# EasyEDA Pro project DAPLink-HS.eprj

# Schematic DAPLink-HS
Board Name: DAPLink-HS; Create Date: 2023-05-25; Page Name: Core; Project Name: DAPLink-HS; Schematic Name: DAPLink-HS; Update Date: 2025-05-06; Company: 嘉立创EDA; Page Size: A4; Version: V1.0
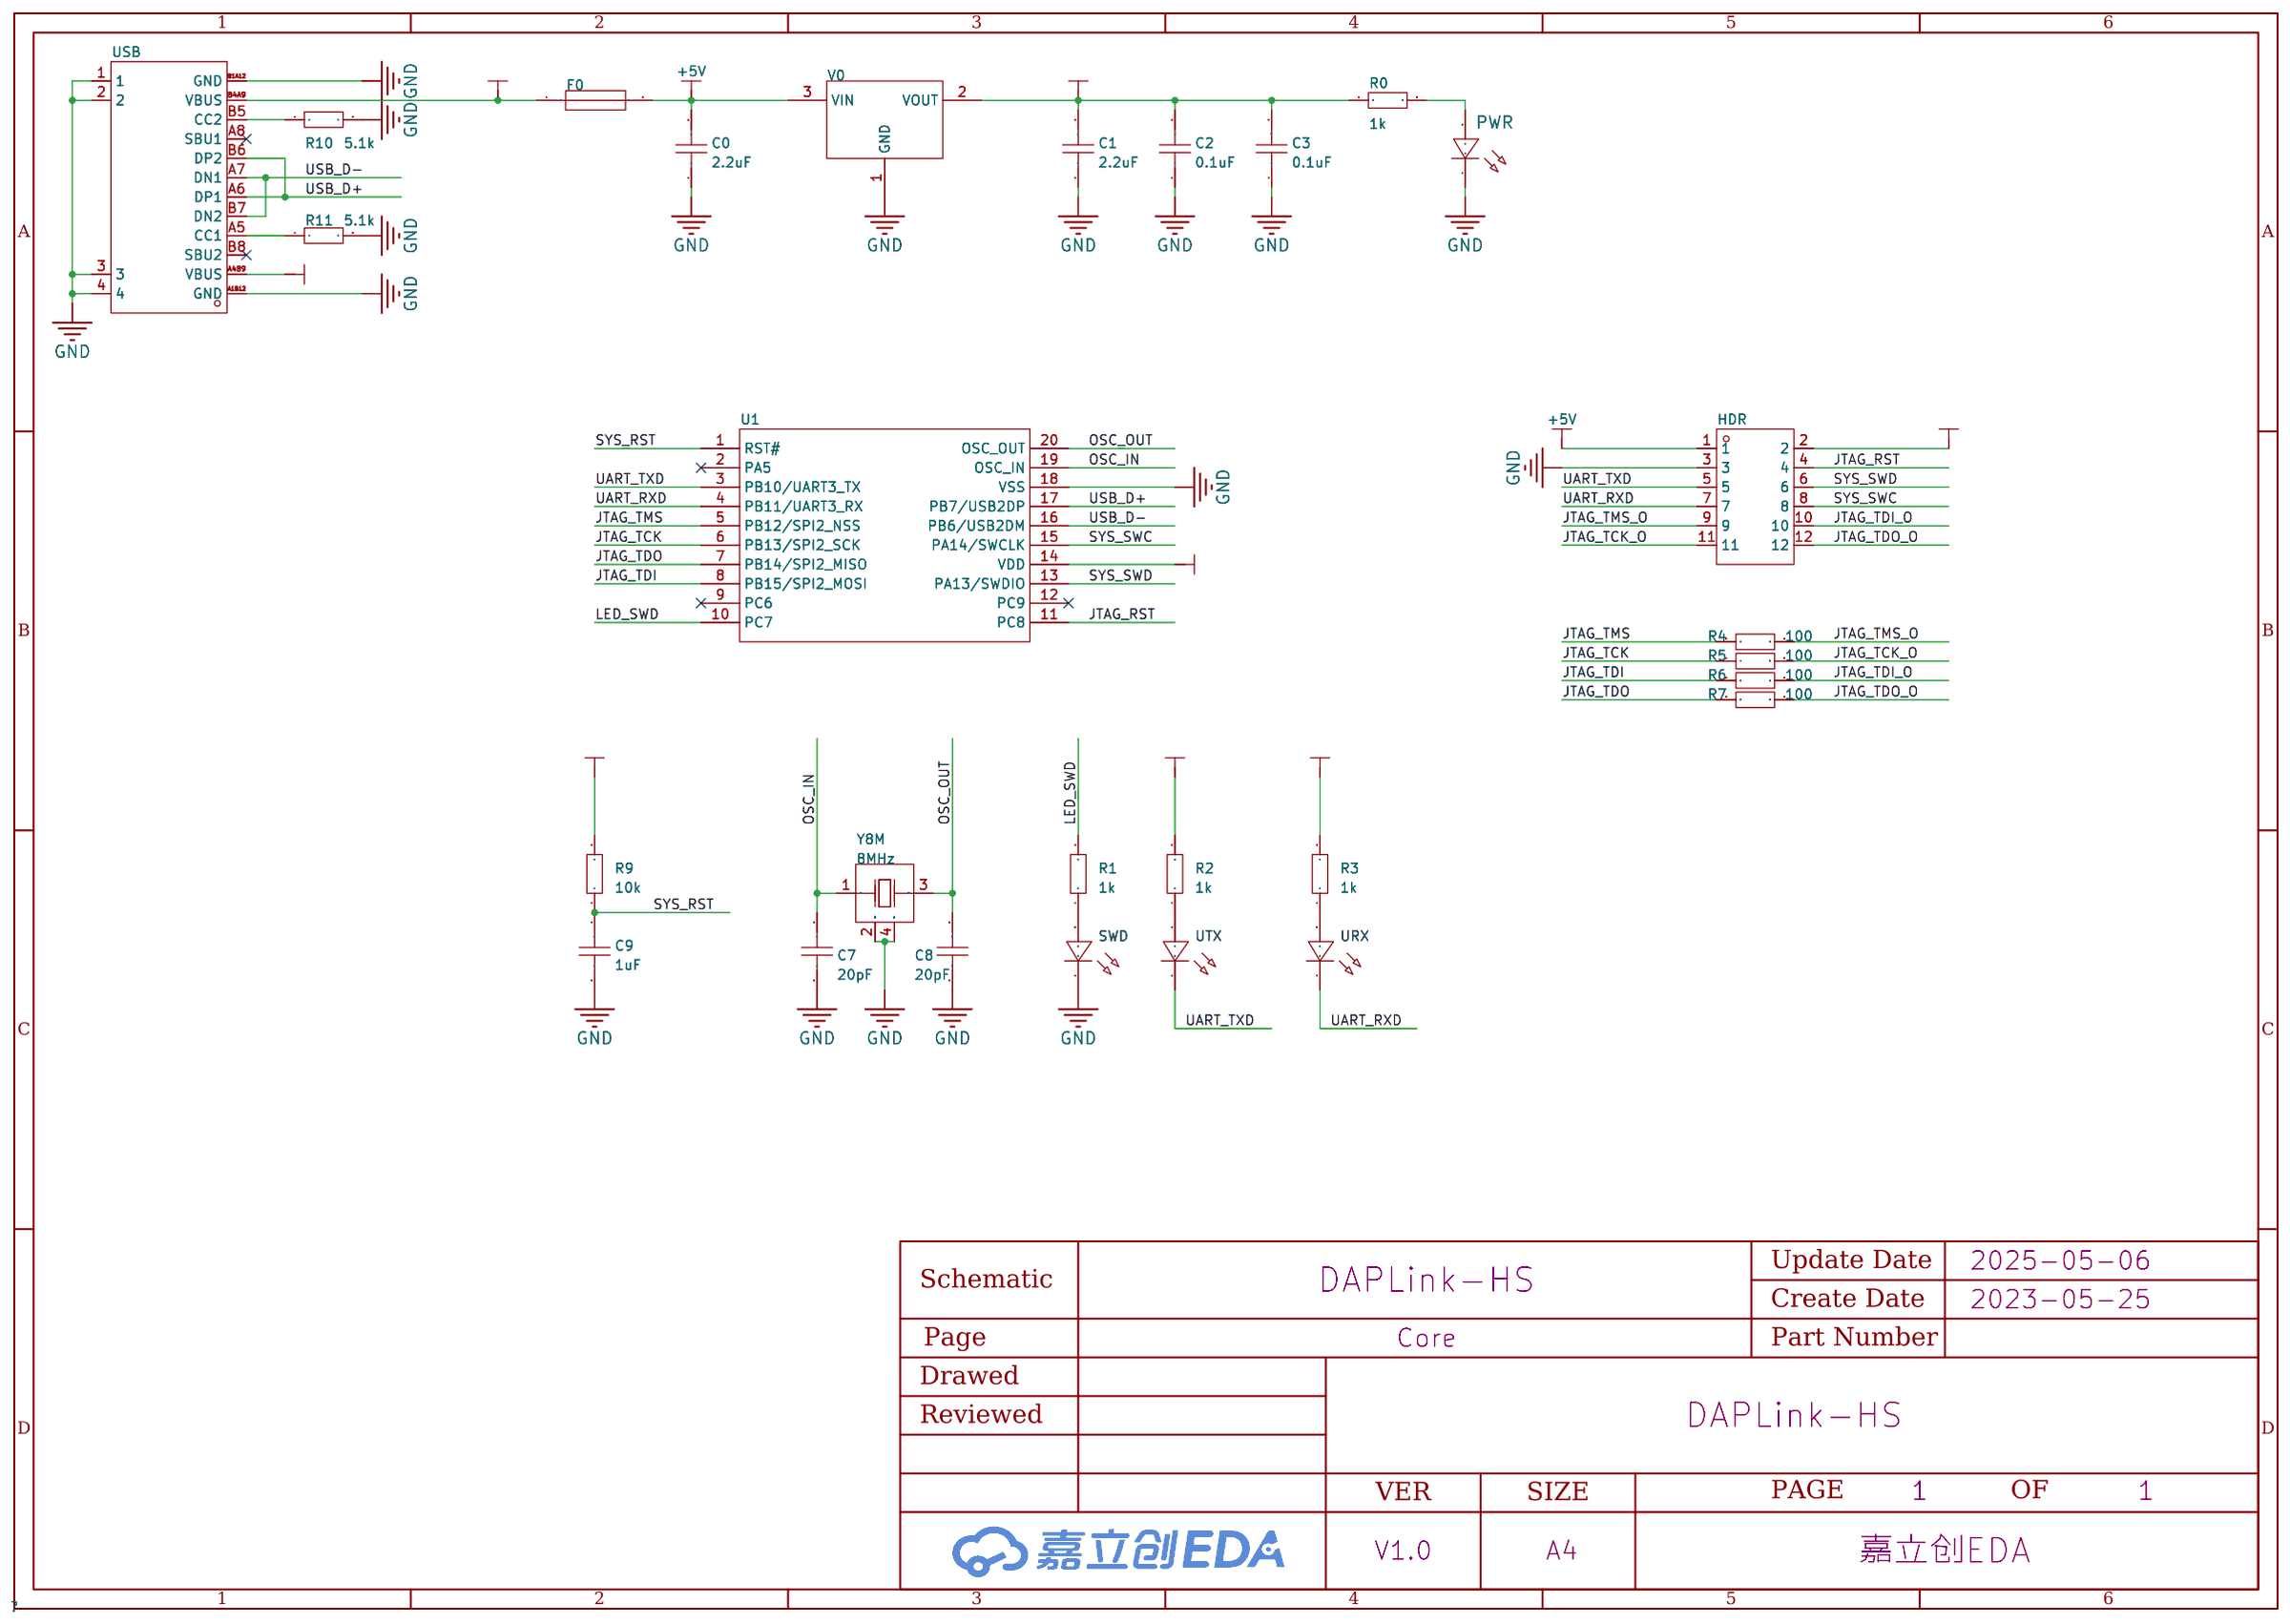
[diagram p0: schematic sheet]

## Parts
C0  2.2uF  [C0603]
C1  2.2uF  [C0603]
C2  0.1uF  [C0603]
C3  0.1uF  [C0603]
C7  20pF  [C0603]
C8  20pF  [C0603]
C9  1uF  [C0603]
F0  JK-nSMD050-30  [F1206]
HDR  -  [HDR-SMD_2X6P-P2.54]
PWR  -  [LED0603-RD_BLUE]
R0  1k  [R0603]
R1  1k  [R0603]
R2  1k  [R0603]
R3  1k  [R0603]
R4  100  [R0603]
R5  100  [R0603]
R6  100  [R0603]
R7  100  [R0603]
R9  10k  [R0603]
R10  5.1k  [R0603]
R11  5.1k  [R0603]
SWD  -  [LED_0603]
U1  -  [TSSOP-20_L6.5-W4.4-P0.65-LS6.4-BL]
URX  -  [LED_0603]
USB  USB-TYPE-C-017  [USB-TYPE-C-SMD_C9900008089]
UTX  -  [LED_0603]
V0  HT7233  [SOT-23-3_L2.9-W1.6-P1.90-LS2.8-BR]
Y8M  8MHz  [OSC-SMD_4P-L3.2-W2.5-BL]

## Library data of the parts
C0-C3 C7-C9 = CAP_0603: 容值:100nF;精度:±10%;额定电压:50V;温度系数:X7R;; Supplier Footprint: 0603
F0 = JK-nSMD050-30: LCSC Part Name: 30V 500mA 1206自恢复; Supplier Part: C720075; Manufacturer: JK(金科); Supplier Footprint: 1206; JLCPCB Part Class: 扩展库; Datasheet: https://atta.szlcsc.com/upload/public/pdf/source/20200810/C720075_06AF2D4541537091880CC35F0EFB49F8.pdf; Supplier: LCSC; Voltage - Max: 30V; Current - Max: 100A; Hold Current: 500mA; Trip Current: 1A; Power Dissipation: 600mW; Resistance - Initial (Ri) (Min): 150mΩ; Resistance - Post Trip (R1) (Max): 300mΩ; Time to Trip(Max): 100ms
HDR = HDR-M_2.54_2x6: Supplier Part: C30734; Supplier Footprint: 插件,P=2.54mm
PWR = LED_0603-R: 发光颜色:红灯;二极管配置:-;透镜颜色:无色透明;主波长:617.5nm;峰值波长:632nm;色温:-;光通量(25时):-;测试电流:5mA;正向电压(VF):2.2V;发光强度:28.5mcd;功率:60mW;发光角度:120°;安装方式:-;工作温度:-40~+85;; Supplier Footprint: 0603; Supplier Part: C72044
R0-R7 R9-R11 = Res_0603: Supplier Footprint: 0603
SWD = LED_0603-G: Supplier Footprint: 0603
U1 = CH32V305FBP6
URX UTX = LED_0603-B: Supplier Footprint: 0603
USB = USB-TYPE-C-017: 连接器类型:Type-C;标准:-;公母:母座;触点数量:16;端口数量:1;安装方式:卧贴;额定电流 - 电源:3A;工作温度范围:-25~+85;; Supplier Part: C2927037; Manufacturer: DEALON(德艺隆); Supplier Footprint: SMD; JLCPCB Part Class: 扩展库; Datasheet: https://atta.szlcsc.com/upload/public/pdf/source/20211217/653222EE5174722C9DFE2966329956D8.pdf; Supplier: LCSC; Connector Type: Type-C; Gender: 母座; Number of Contacts: 16; Number of Ports: 1; Mounting Style: 卧贴; Current Rating - Power (Max): 3A; Operating Temperature Range: -25~+85
V0 = HT7233: LCSC Part Name: 输入8V 输出3.3V 300mA; Supplier Part: C47970; Manufacturer: HOLTEK(合泰/盛群); Supplier Footprint: SOT-23; JLCPCB Part Class: 扩展库; Datasheet: https://atta.szlcsc.com/upload/public/pdf/source/20240403/3BB5021AF80A3BCA9E8A25AC89304087.pdf; Supplier: LCSC; Output Type: 固定; Maximum Input Voltage: 8V; Output Voltage: 3.3V; MAX Output Current: 300mA; Dropout Voltage: 300mV@(300mA); Output Polarity: 正极; Number of Outputs: 1
Y8M = X322512MSB4SI: 晶振类型:贴片无源晶振;频率:12MHz;频率公差:±10ppm;频率稳定度:±30ppm;负载电容:20pF;工作温度:-40~+85;; LCSC Part Name: 12MHz ±10ppm 20pF; Supplier Part: C9002; Manufacturer: YXC(扬兴晶振); Supplier Footprint: SMD3225-4P; JLCPCB Part Class: 基础库; Datasheet: https://atta.szlcsc.com/upload/public/pdf/source/20210329/C112971_1F611BDC486E193C1706F6D8EB5AA189.pdf; Supplier: LCSC; Crystal Type: 贴片无源晶振; Frequency Tolerance: ±10ppm; Frequency Stability: ±30ppm; Load Capacitance: 20pF; Operating Temperature: -40~+85

## Nets
+3.3V: C1.2 C2.2 C3.2 HDR.2 R0.1 R2.2 R3.2 R9.2 U1.14(VDD) V0.2(VOUT)
+5V: C0.2 F0.2 HDR.1 V0.3(VIN)
GND: C0.1 C1.1 C2.1 C3.1 C7.2 C8.1 C9.2 HDR.3 PWR.1(C) R10.2 R11.2 SWD.1(C) U1.18(VSS) USB.1 USB.2 USB.3 USB.4 USB.A1B12(GND) USB.B1A12(GND) V0.1(GND) Y8M.2(GND) Y8M.4(GND)
VBUS: F0.1 USB.A4B9(VBUS) USB.B4A9(VBUS)
JTAG_RST: HDR.4 U1.11(PC8)
JTAG_TCK: R5.1 U1.6(PB13/SPI2_SCK)
JTAG_TCK_O: HDR.11 R5.2
JTAG_TDI: R6.1 U1.8(PB15/SPI2_MOSI)
JTAG_TDI_O: HDR.10 R6.2
JTAG_TDO: R7.1 U1.7(PB14/SPI2_MISO)
JTAG_TDO_O: HDR.12 R7.2
JTAG_TMS: R4.1 U1.5(PB12/SPI2_NSS)
JTAG_TMS_O: HDR.9 R4.2
LED_SWD: R1.2 U1.10(PC7)
OSC_IN: C7.1 U1.19(OSC_IN) Y8M.1(OSC1)
OSC_OUT: C8.2 U1.20(OSC_OUT) Y8M.3(OSC2)
SYS_RST: C9.1 R9.1 U1.1(RST#)
SYS_SWC: HDR.8 U1.15(PA14/SWCLK)
SYS_SWD: HDR.6 U1.13(PA13/SWDIO)
UART_RXD: HDR.7 U1.4(PB11/UART3_RX) URX.1(C)
UART_TXD: HDR.5 U1.3(PB10/UART3_TX) UTX.1(C)
USB_D+: U1.17(PB7/USB2DP) USB.A6(DP1) USB.B6(DP2)
USB_D-: U1.16(PB6/USB2DM) USB.A7(DN1) USB.B7(DN2)
$1N2511: R11.1 USB.A5(CC1)
$1N2512: R10.1 USB.B5(CC2)
$1N2528: PWR.2(A) R0.2
$1N14595: R1.1 SWD.2(A)
$1N14645: R2.1 UTX.2(A)
$1N14672: R3.1 URX.2(A)

Not connected (* = marked no-connect by the designer): U1 2(PA5)* 9(PC6)* 12(PC9)*; USB A8(SBU1)* B8(SBU2)*

# Board DAPLink-HS
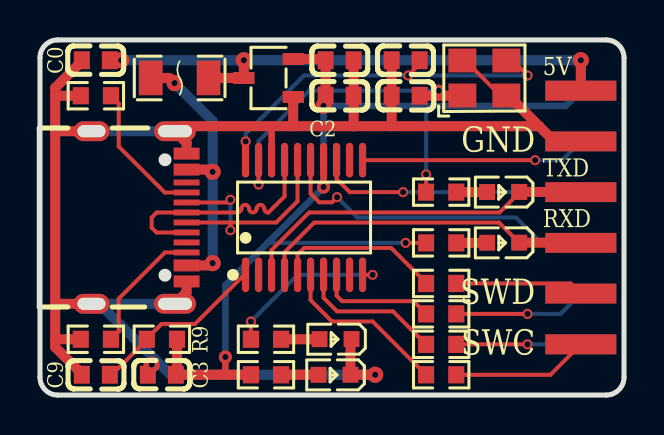
[diagram p1: board, top side]
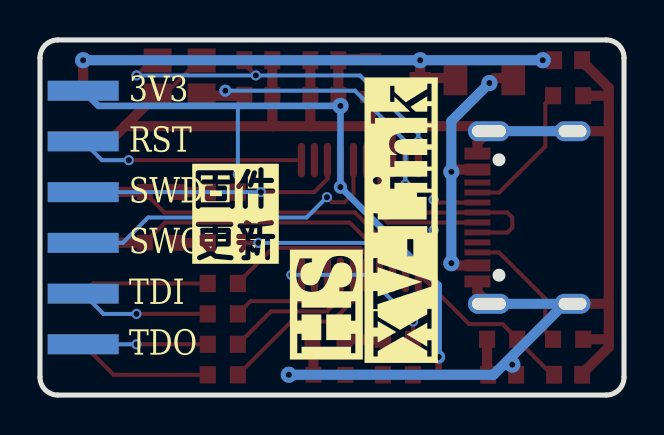
[diagram p2: board, bottom side, seen from below]

Outline 29.21 x 17.78 mm; copper layers: Top Layer, Bottom Layer. Coordinates in mm from the lower left corner of the outline.
Outline path: 0,16.89 0,0.89 arc(0.26,0.26) 0.89,0 28.32,0 arc(28.95,0.26) 29.21,0.89 29.21,16.89 arc(28.95,17.52) 28.32,17.78 0.89,17.78 arc(0.26,17.52) 0,16.89
Stack: Top Layer 0.035mm / Dielectric1 1.51mm FR4 er 4.5 / Bottom Layer 0.035mm

## Design rules (mm)
net USB_D+: DP1
net USB_D-: DP1
spacing safeClearance (default): track to track 0.152, other pairs 0.152 to 0.3
track width trackWidth (default): min 0.127, default 0.254, max 2.54
differential pair differentialPair (default): width min 0.127, default 0.254, max 2.54; gap min 0.152, default 0.152
via viaSize (default): diameter min 0.5, default 0.61, max 10; hole min 0.3, default 0.305, max 6

## Placement (name value [footprint] x y rotation side)
C0  2.2uF  [C0603]  2.79 16.76 0 top
C1  2.2uF  [C0603]  14.99 16.76 180 top
C2  0.1uF  [C0603]  14.99 14.99 180 top
C3  0.1uF  [C0603]  6.1 1.02 0 top
C7  20pF  [C0603]  18.29 14.99 180 top
C8  20pF  [C0603]  18.29 16.76 0 top
C9  1uF  [C0603]  2.79 1.02 180 top
F0  JK-nSMD050-30  [F1206]  6.99 15.88 0 top
HDR  -  [HDR-SMD_2X6P-P2.54]  27.05 15.24 0 top
PWR  -  [LED0603-RD_BLUE]  14.73 1.02 180 top
R0  1k  [R0603]  11.3 1.02 0 top
R1  1k  [R0603]  11.3 2.79 180 top
R2  1k  [R0603]  20.07 10.16 180 top
R3  1k  [R0603]  20.07 7.62 180 top
R4  100  [R0603]  20.07 5.59 0 top
R5  100  [R0603]  20.07 1.02 0 top
R6  100  [R0603]  20.07 4.06 0 top
R7  100  [R0603]  20.07 2.54 0 top
R9  10k  [R0603]  6.1 2.79 0 top
R10  5.1k  [R0603]  2.79 2.79 180 top
R11  5.1k  [R0603]  2.79 14.99 180 top
SWD  -  [LED_0603]  14.73 2.79 180 top
U1  -  [TSSOP-20_L6.5-W4.4-P0.65-LS6.4-BL]  13.21 8.89 0 top
URX  -  [LED_0603]  23.11 7.62 180 top
USB  USB-TYPE-C-017  [USB-TYPE-C-SMD_C9900008089]  4.95 8.89 270 top
UTX  -  [LED_0603]  23.11 10.16 180 top
V0  HT7233  [SOT-23-3_L2.9-W1.6-P1.90-LS2.8-BR]  11.43 15.88 0 top
Y8M  8MHz  [OSC-SMD_4P-L3.2-W2.5-BL]  22.22 15.88 0 top

## Footprints (pads in the part's own frame, mm; a bottom-side part is the same pattern mirrored in y, then rotated)
C0603
  rect 0.8x0.9 smd: 1(-0.7,0) 2(0.7,0)
F1206
  rect 1.19x1.728 smd: 1(-1.445,0) 2(1.445,0)
HDR-SMD_2X6P-P2.54
  rect 3.556x1 smd: 1(0,0) 3(0,-2.54) 5(0,-5.08) 7(0,-7.62) 9(0,-10.16) 11(0,-12.7)
  rect 3.556x1 smd far side: 2(0,0) 4(0,-2.54) 6(0,-5.08) 8(0,-7.62) 10(0,-10.16) 12(0,-12.7)
LED0603-RD_BLUE
  rect 0.8x0.8 smd: 1(-0.8,-0.003) 2(0.8,0.003)
LED_0603
  rect 0.8x0.8 smd: 1(-0.851,-0.01) 2(0.75,-0.005)
OSC-SMD_4P-L3.2-W2.5-BL
  rect 1.4x1.2 smd: 1(-1.1,-0.875) 2(1.1,-0.875) 3(1.1,0.875) 4(-1.1,0.875)
R0603
  rect 0.806x0.864 smd: 1(-0.753,0) 2(0.753,0)
SOT-23-3_L2.9-W1.6-P1.90-LS2.8-BR
  rect 1.07x0.6 smd: 1(1.235,-0.95) 2(1.235,0.95) 3(-1.235,0)
TSSOP-20_L6.5-W4.4-P0.65-LS6.4-BL
  oval 0.364x1.742 smd: 1(-2.925,-2.871) 2(-2.275,-2.871) 3(-1.625,-2.871) 4(-0.975,-2.871) 5(-0.325,-2.871) 6(0.325,-2.871) 7(0.975,-2.871) 8(1.625,-2.871) 9(2.275,-2.871) 10(2.925,-2.871) 11(2.925,2.871) 12(2.275,2.871) 13(1.625,2.871) 14(0.975,2.871) 15(0.325,2.871) 16(-0.325,2.871) 17(-0.975,2.871) 18(-1.625,2.871) 19(-2.275,2.871) 20(-2.925,2.871)
USB-TYPE-C-SMD_C9900008089
  oval 1x2.1 hole 0.6x1.7: 1(-4.32,1.801) 2(4.32,1.801)
  oval 1x1.8 hole 0.6x1.4: 3(-4.32,-2.379) 4(4.32,-2.379)
  rect 0.6x1.3 smd: A1B12(-3.2,2.379) A4B9(-2.4,2.379) B1A12(3.2,2.379) B4A9(2.4,2.379)
  rect 0.3x1.3 smd: A5(-1.25,2.379) A6(-0.25,2.379) A7(0.25,2.379) A8(1.25,2.379) B5(1.75,2.379) B6(0.75,2.379) B7(-0.75,2.379) B8(-1.75,2.379)

## Nets
As in the schematic.

Pads without a net: U1 2 9 12; USB A8 B8

## Via types
v1: diameter 0.813, hole 0.305, Top Layer to Bottom Layer, 9 vias
v2: diameter 0.508, hole 0.305, Top Layer to Bottom Layer, 15 vias
v3: diameter 0.66, hole 0.305, Top Layer to Bottom Layer, 2 vias
v4: diameter 0.61, hole 0.305, Top Layer to Bottom Layer, 1 via

## Routing (per net, layer and track width the routed paths; a pad name or vN(x,y) marks a point on that pad's centre or on a via; arc(x,y) is an arc through that point)
+3.3V: length 51.2
  Top Layer w0.203: R3.2 v2(18.29,7.62) ; R2.2 v2(19.31,11.05)
  Top Layer w0.33: U1.14 v3(14.18,10.41) ; v3(9.27,1.91) 9.27,1.02
  Top Layer w0.508: C2.2 C1.2 14.22,16.83 12.66,16.83 ; R9.2 6.85,1.07 C3.2 R0.1
  Bottom Layer w0.203: v2(19.31,11.05) 19.31,14.48 ; v2(18.29,7.62) 11.39,7.62
  Bottom Layer w0.33: HDR.2 26.29,14.48 v1(14.18,14.48) v3(14.18,10.41) 9.27,5.5 v3(9.27,1.91)
+5V: length 27.7
  Top Layer w0.508: v1(10.19,16.76) V0.3 F0.2 ; HDR.1 v1(27.05,16.76) ; C0.2 v1(4.06,16.76)
  Bottom Layer w0.508: v1(4.06,16.76) v1(10.19,16.76) v1(27.05,16.76)
GND: length 88.1
  Top Layer w0.203: Y8M.4 21.27,16.75 23.02,15 Y8M.2
  Top Layer w0.33: U1.18 11.58,13.46
  Top Layer w0.508: 15.69,13.46 12.66,13.46 ; 15.69,13.46 17.59,13.46 ; 15.69,13.46 C2.1 C1.1 ; 12.66,13.46 12.66,14.92 ; 12.66,13.46 7.01,13.46 USB.1 7.33,12.63 USB.A1B12 ; v1(16.76,1.02) 15.53,1.02 PWR.1 15.53,2.75 SWD.1 ; 0.76,4.57 0.76,2.79 ; 0.76,4.57 0.76,13.21 ; 0.76,4.57 USB.4 ; 0.76,2.79 R10.2 ; 0.76,2.79 0.76,2.4 2.09,1.07 C9.2 ; 17.59,13.46 C7.2 C8.1 ; 17.59,13.46 24.96,13.46 ; C0.1 2.09,16.71 0.76,15.38 0.76,14.99 ; 0.76,13.21 USB.3 ; 0.76,13.21 0.76,14.99 ; USB.2 7.33,5.15 USB.B1A12 ; Y8M.2 23.43,15 24.96,13.46 ; 24.96,13.46 25.72,12.7 HDR.3 ; R11.2 0.76,14.99
  Bottom Layer w0.508: 2.97,4.57 USB.2 ; 2.97,4.57 6.53,1.02 v1(16.76,1.02) ; 2.97,4.57 USB.4 ; USB.3 USB.1
  vias: v1(5.59,1.52)
VBUS: length 13.8
  Top Layer w0.508: USB.A4B9 8.52,11.29 v1(8.64,11.18) ; F0.1 6.48,15.88 v1(6.73,15.62) ; v1(8.64,6.6) 8.52,6.49 USB.B4A9
  Bottom Layer w0.508: v1(6.73,15.62) 8.64,13.72 v1(8.64,11.18) v1(8.64,6.6)
JTAG_RST: length 11.3
  Top Layer w0.203: U1.11 v2(24.76,11.76)
  Bottom Layer w0.203: HDR.4 26.11,11.76 v2(24.76,11.76)
JTAG_TCK: length 8.6
  Top Layer w0.203: U1.6 13.53,4.75 14.6,3.68 16.64,3.68 19.3,1.02 R5.1
JTAG_TCK_O: length 6.9
  Top Layer w0.203: HDR.11 25.53,1.02 R5.2
JTAG_TDI: length 5.9
  Top Layer w0.203: R6.1 18.68,4.7 15.11,4.7 14.83,4.98 U1.8
JTAG_TDI_O: length 6.7
  Top Layer w0.203: R6.2 v2(24.38,4.06)
  Bottom Layer w0.203: v2(24.38,4.06) 26.03,4.06 HDR.10
JTAG_TDO: length 7.2
  Top Layer w0.203: U1.7 14.18,4.87 14.86,4.19 17.65,4.19 19.3,2.54 R7.1
JTAG_TDO_O: length 6.2
  Top Layer w0.203: R7.2 v2(24.38,2.54)
  Bottom Layer w0.203: v2(24.38,2.54) HDR.12
JTAG_TMS: length 8.3
  Top Layer w0.203: R4.1 19.31,5.62 17.56,7.37 13.21,7.37 12.88,7.04 U1.5
JTAG_TMS_O: length 6.4
  Top Layer w0.203: R4.2 26.54,5.59 HDR.9
LED_SWD: length 8.4
  Top Layer w0.203: R1.2 v2(10.55,3.68) ; U1.10 v2(16.64,6.02)
  Bottom Layer w0.203: v2(16.64,6.02) 12.89,6.02 v2(10.55,3.68)
OSC_IN: length 15.6
  Top Layer w0.203: U1.19 v2(10.93,10.54)
  Top Layer w0.508: C7.1 21.11,14.99 Y8M.1
  Bottom Layer w0.203: v2(10.93,10.54) 10.93,12.71 13.46,15.24 v4(19.94,15.24)
OSC_OUT: length 19
  Top Layer w0.203: U1.20 10.29,11.77 v2(10.29,12.7) ; C8.2 18.99,16.58 v2(18.41,16) ; v2(24.38,16) 23.64,16.75 Y8M.3
  Bottom Layer w0.203: v2(10.29,12.7) 10.29,13.08 13.21,16 v2(18.41,16) v2(24.38,16)
SYS_RST: length 8.9
  Top Layer w0.203: C9.1 3.59,1.02 5.34,2.77 R9.1 5.34,2.82 6.08,3.56 7.75,3.56 10.21,6.02 U1.1
SYS_SWC: length 16.4
  Top Layer w0.203: v2(14.86,9.91) 14.6,9.65 13.97,9.65 13.53,10.09 U1.15
  Bottom Layer w0.203: v2(14.86,9.91) 15.88,8.89 23.8,8.89 25.07,7.62 HDR.8
SYS_SWD: length 13.4
  Top Layer w0.203: v2(18.16,10.16) 15.49,10.16 14.83,10.82 U1.13
  Bottom Layer w0.203: HDR.6 v2(18.16,10.16)
UART_RXD: length 17
  Top Layer w0.203: URX.1 22.96,8.64 13.72,8.64 12.23,7.15 U1.4
  Top Layer w0.508: HDR.7 27.04,7.63 URX.1
UART_TXD: length 17.9
  Top Layer w0.203: U1.3 11.58,7.27 13.46,9.14 22.99,9.14 23.97,10.12 UTX.1
  Top Layer w0.508: HDR.5 27.04,10.17 UTX.1
USB_D+: length 12.1
  Top Layer w0.203: U1.17 12.23,9.95 11.43,9.14 11.41,9.14 arc(11.27,9.2) 11.22,9.33 11.22,9.33 arc(11.03,9.53) 10.83,9.33 10.83,9.33 arc(10.64,9.14) 10.45,9.33 10.45,9.33 arc(10.26,9.53) 10.07,9.33 10.07,9.33 arc(10.02,9.2) 9.88,9.14 USB.A6 5.84,9.14 5.59,8.89 5.59,8.38 5.83,8.14 USB.B6
USB_D-: length 12.2
  Top Layer w0.203: v2(9.53,8.25) 9.53,8.64 ; 9.53,8.64 11.81,8.64 12.88,9.71 U1.16 ; 9.53,8.64 USB.A7 ; v2(9.53,9.78) 9.39,9.64 USB.B7
  Bottom Layer w0.203: v2(9.53,9.78) v2(9.53,8.25)
$1N2511: length 7.1
  Top Layer w0.203: R11.1 3.94,14.6 3.94,12.45 6.24,10.14 USB.A5
$1N2512: length 6.5
  Top Layer w0.203: R10.1 3.94,3.18 3.94,4.83 6.25,7.14 USB.B5
$1N2528: length 1.9
  Top Layer w0.508: PWR.2 13.93,1.02 R0.2
$1N14595: length 1.9
  Top Layer w0.508: R1.1 13.98,2.79 13.98,2.8
$1N14645: length 1.5
  Top Layer w0.508: UTX.2 22.36,10.16 R2.1
$1N14672: length 1.5
  Top Layer w0.508: R3.1 22.36,7.62 URX.2

## Text on the board
Bottom Silkscreen Layer: 3V3 | RST | SWD | SWC | TDI | TDO | 固件 / 更新 | XV-Link | HS
Top Silkscreen Layer: 5V | TXD | RXD | GND | SWD | SWC
